# Altium schematic sheet AC-DC.SchDoc
size Letter; DocumentNumber: 6; SheetNumber: 6; SheetTotal: 11; Pagesize: Letter
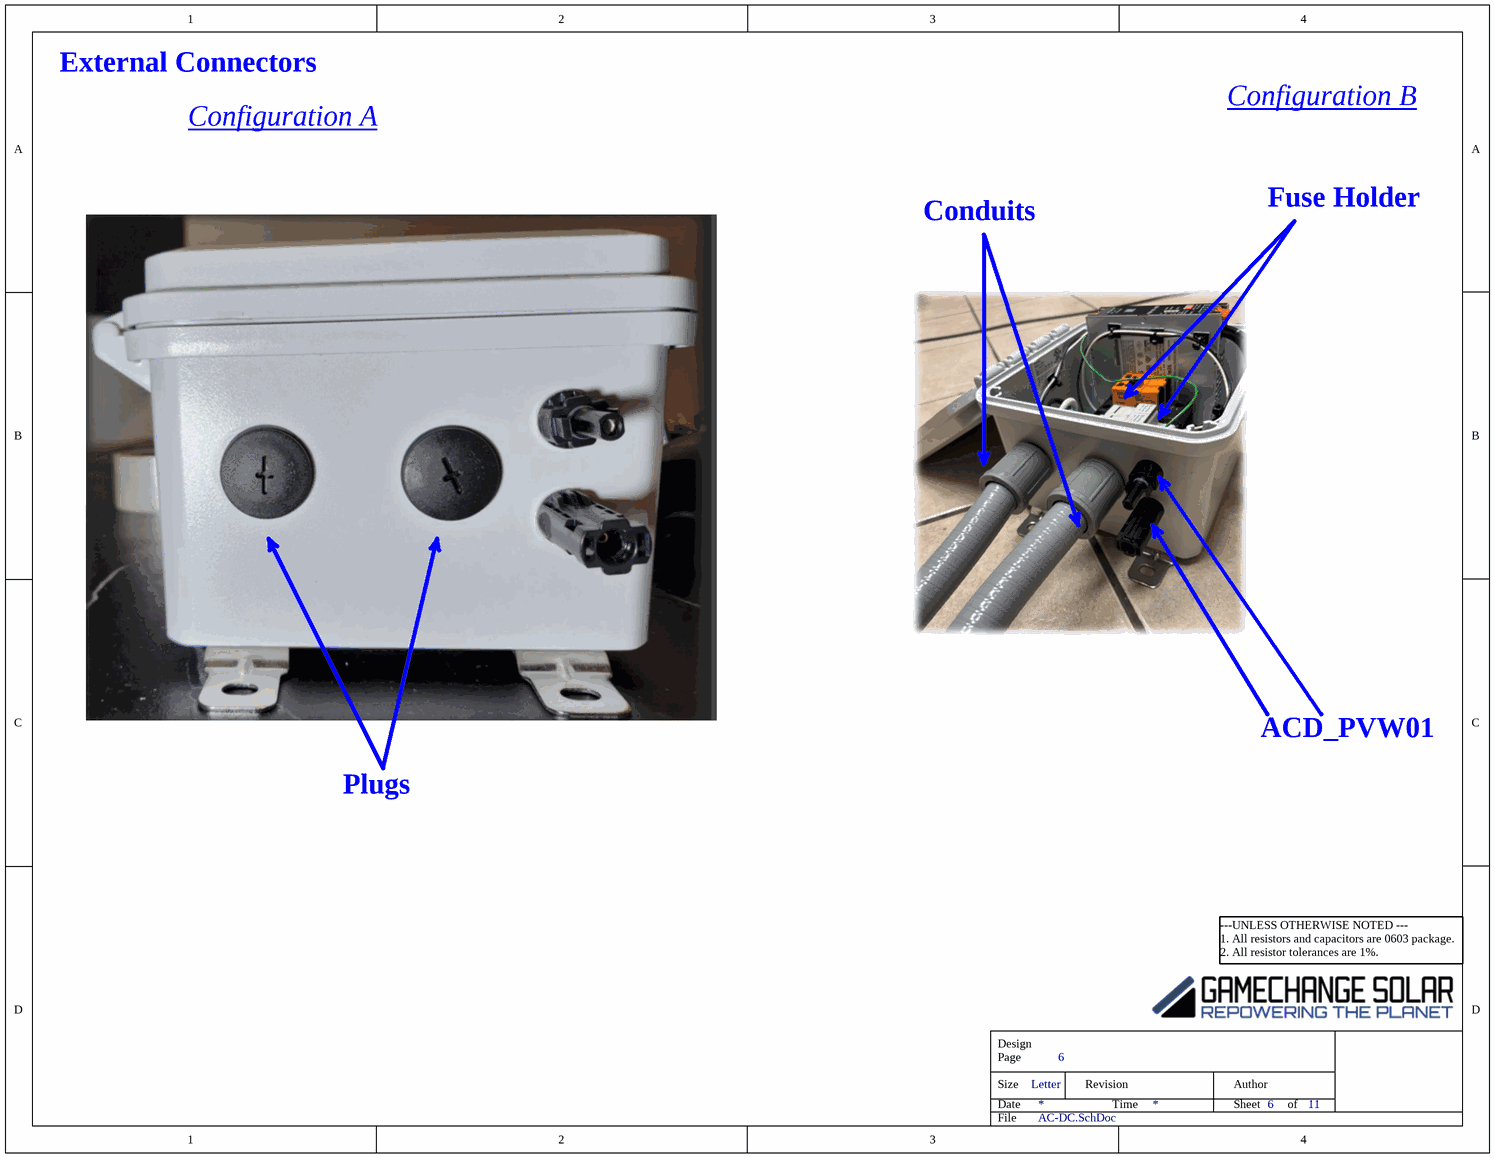
[diagram p0: AC-DC.SchDoc]

## Notes on the sheet
- External Connectors
- Configuration A
- Configuration B
- Conduits
- Fuse Holder
- ACD_PVW01
- Plugs
- ---UNLESS OTHERWISE NOTED ---
  1. All resistors and capacitors are 0603 package.
  2. All resistor tolerances are 1%.
- Design
- Size
- Date
- Page
- Revision
- Time
- Sheet
- Author
- of
- File